# EAGLE design Lower-board (EAGLE 7.1.0)
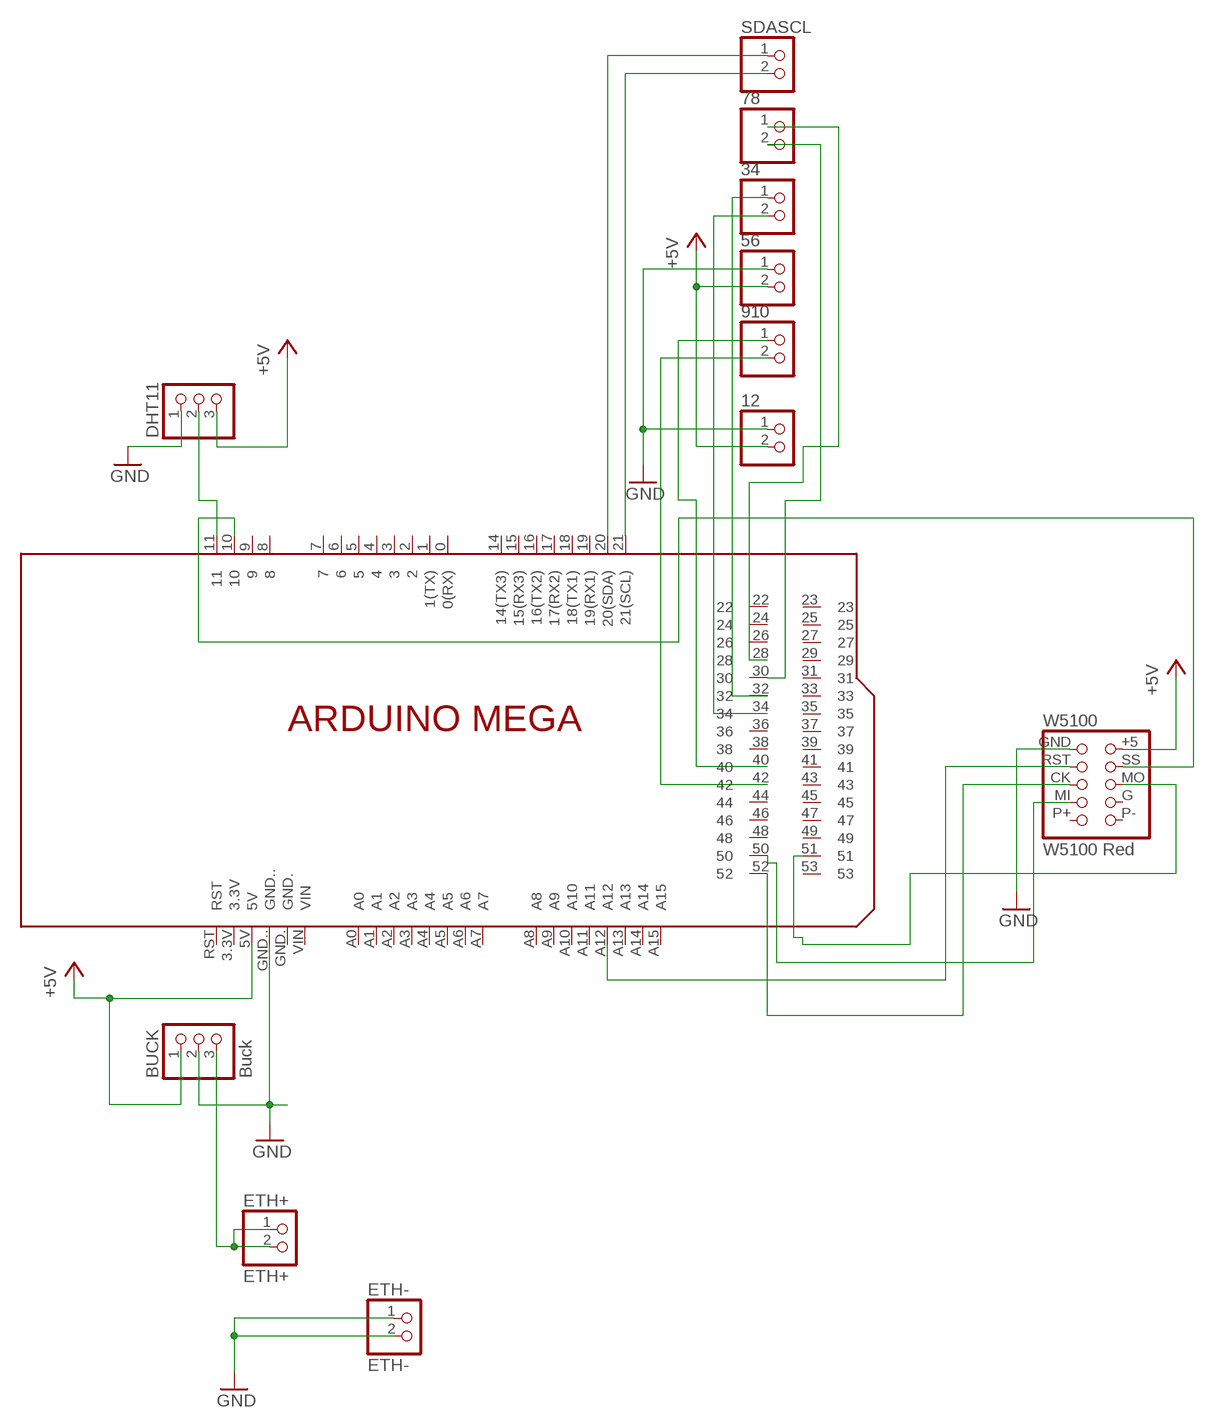
[diagram p0: schematic, sheet 1]

## Parts
12  PINHD-1X2  [1X02]
34  PINHD-1X2  [1X02]
56  PINHD-1X2  [1X02]
78  PINHD-1X2  [1X02]
910  PINHD-1X2  [1X02]
BUCK  Buck  PINHD-1X3  [1X03]
DHT11  PINHD-1X3  [1X03]
ETH+  ETH+  PINHD-1X2  [1X02]
ETH-  ETH-  PINHD-1X2  [1X02]
SDASCL  PINHD-1X2  [1X02]
U$1  ARDUINO_MEGA_1  [ARDUINO_MEGA_1]
W5100  W5100 Red  W5100-REDW5100-RED  [W5100-RED]

## Nets
+5V: 12.2 56.2 BUCK.1 DHT11.3 U$1.5V W5100.+5
GND: 12.1 56.1 BUCK.2 DHT11.1 ETH-.1 ETH-.2 U$1.GND.. W5100.GND
N$1: BUCK.3 ETH+.1 ETH+.2
N$2: SDASCL.2 U$1.21(21(SCL))
N$3: SDASCL.1 U$1.20(20(SDA))
N$4: DHT11.2 U$1.11
N$6: 910.2 U$1.42
N$7: 910.1 U$1.40
N$8: 34.2 U$1.34
N$9: 34.1 U$1.32
N$10: 78.1 U$1.28
N$12: 78.2 U$1.30
N$23: U$1.52 W5100.CK
N$24: U$1.50 W5100.MI
N$25: U$1.A12 W5100.RST
N$26: U$1.10 W5100.SS
N$27: U$1.51 W5100.MO
Unconnected: U$1.0(0(RX)) U$1.1(1(TX)) U$1.2 U$1.3 U$1.3.3V U$1.4 U$1.5 U$1.6 U$1.7 U$1.8 U$1.9 U$1.14(14(TX3)) U$1.15(15(RX3)) U$1.16(16(TX2)) U$1.17(17(RX2)) U$1.18(18(TX1)) U$1.19(19(RX1)) U$1.22 U$1.23 U$1.24 U$1.25 U$1.26 U$1.27 U$1.29 U$1.31 U$1.33 U$1.35 U$1.36 U$1.37 U$1.38 U$1.39 U$1.41 U$1.43 U$1.44 U$1.45 U$1.46 U$1.47 U$1.48 U$1.49 U$1.53 U$1.A0 U$1.A1 U$1.A2 U$1.A3 U$1.A4 U$1.A5 U$1.A6 U$1.A7 U$1.A8 U$1.A9 U$1.A10 U$1.A11 U$1.A13 U$1.A14 U$1.A15 U$1.GND. U$1.RST U$1.VIN W5100.G W5100.P+ W5100.P-

## Library data of the parts
12 34 56 78 910 ETH+ ETH- SDASCL = pinhead:PINHD-1X2: PIN HEADER
BUCK DHT11 = pinhead:PINHD-1X3: PIN HEADER
U$1 = Mat-Library:ARDUINO_MEGA_1
W5100 = w5100:W5100-RED: PIN HEADER

## Board
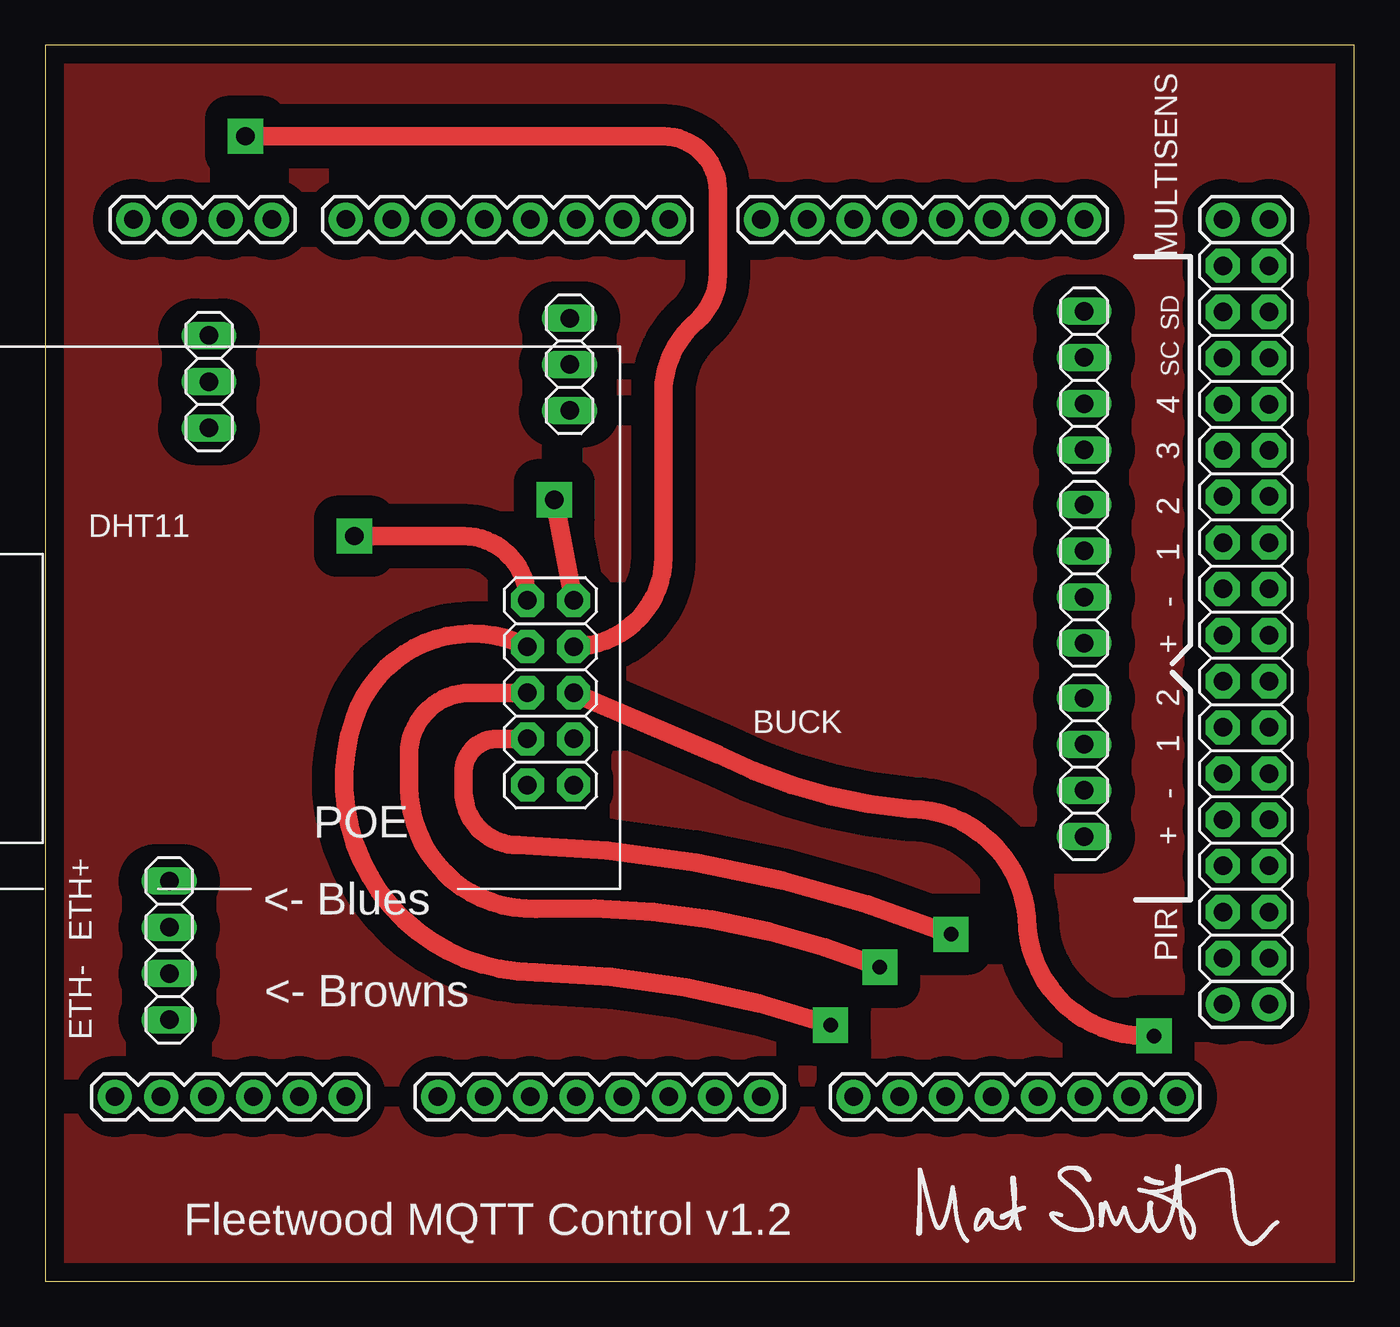
[diagram p1: board, top side]
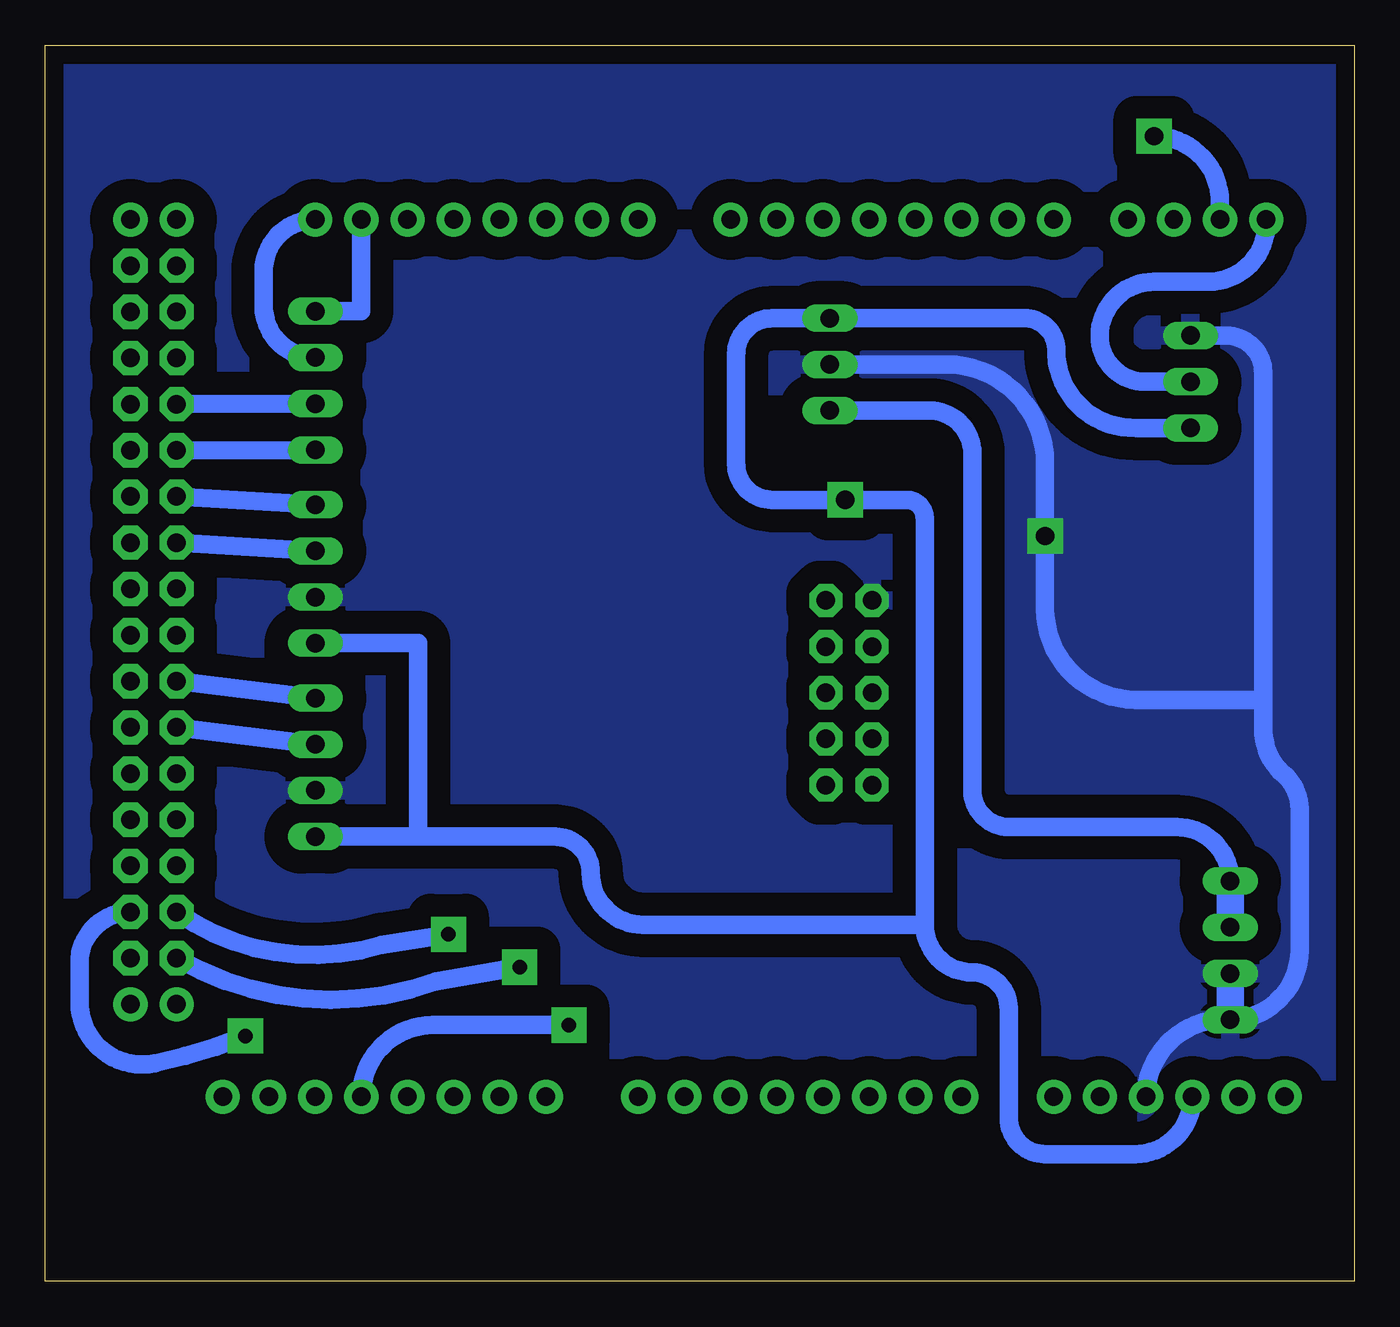
[diagram p2: board, bottom side, seen from below]

Size 72 x 68 mm. Coordinates in mm from the lower left corner, seen from the top.
Outline: 0,0 72,0 72,68 0,68 0,0
Copper layers (1*16): Top 0.035mm / dielectric 1.5mm / Bottom 0.035mm
Design rules "mat-homemade *": minimum track width 20mil, minimum drill 24mil, track to track 50mil, track to pad 30mil, pad to pad 25mil, via to via 30mil, smd to smd 8mil, copper to edge 40mil, drill to drill 8mil, minimum pad ring 10mil, minimum via ring 8mil, stop-mask expansion 4mil, vias tented up to drill 0mil, thermal gap 10mil

### Footprints (pad centres in the part's own frame; a part is rotated, then mirrored left to right if it is on the bottom)
1X02 = drill 1.016 long: 1 -1.27,0; 2 1.27,0
1X03 = drill 1.016 long: 1 -2.54,0; 2 0,0; 3 2.54,0
ARDUINO_MEGA_1 = drill 1.016 pad 1.88: 0 31.75,50.8; 1 29.21,50.8; 2 26.67,50.8; 3 24.13,50.8; 3.3V 3.81,2.54; 4 21.59,50.8; 5 19.05,50.8; 5V 6.35,2.54; 5V. 62.23,50.8; 5V.. 64.77,50.8; 6 16.51,50.8; 7 13.97,50.8; 8 9.906,50.8; 9 7.366,50.8; 10 4.826,50.8; 11 2.286,50.8; 14 36.83,50.8; 15 39.37,50.8; 16 41.91,50.8; 17 44.45,50.8; 18 46.99,50.8; 19 49.53,50.8; 20 52.07,50.8; 21 54.61,50.8; A0 19.05,2.54; A1 21.59,2.54; A2 24.13,2.54; A3 26.67,2.54; A4 29.21,2.54; A5 31.75,2.54; A6 34.29,2.54; A7 36.83,2.54; A8 41.91,2.54; A9 44.45,2.54; A10 46.99,2.54; A11 49.53,2.54; A12 52.07,2.54; A13 54.61,2.54; A14 57.15,2.54; A15 59.69,2.54; GND. 11.43,2.54; GND.. 8.89,2.54; GND... 62.23,7.62; GND.... 64.77,7.62; RST 1.27,2.54; VIN 13.97,2.54 | drill 1.016 pad 1.88 octagon: 22 62.23,48.26; 23 64.77,48.26; 24 62.23,45.72; 25 64.77,45.72; 26 62.23,43.18; 27 64.77,43.18; 28 62.23,40.64; 29 64.77,40.64; 30 62.23,38.1; 31 64.77,38.1; 32 62.23,35.56; 33 64.77,35.56; 34 62.23,33.02; 35 64.77,33.02; 36 62.23,30.48; 37 64.77,30.48; 38 62.23,27.94; 39 64.77,27.94; 40 62.23,25.4; 41 64.77,25.4; 42 62.23,22.86; 43 64.77,22.86; 44 62.23,20.32; 45 64.77,20.32; 46 62.23,17.78; 47 64.77,17.78; 48 62.23,15.24; 49 64.77,15.24; 50 62.23,12.7; 51 64.77,12.7; 52 62.23,10.16; 53 64.77,10.16
W5100-RED = drill 1.016 pad 1.829 octagon: +5 48.26,15.875; CK 45.72,10.795; G 48.26,8.255; GND 45.72,15.875; MI 45.72,8.255; MO 48.26,10.795; P+ 45.72,5.715; P- 48.26,5.715; RST 45.72,13.335; SS 48.26,13.335

### Placement (x,y rotation side)
12  57.15,25.74 270 top
34  57.15,41.46 270 top
56  57.15,36.38 270 top
78  57.15,47.02 270 top
910  57.15,30.82 270 top
BUCK  28.84,50.45 270 top
DHT11  9,49.5 270 top
ETH+  6.81,20.75 270 top
ETH-  6.81,15.67 90 top
SDASCL  57.15,52.1 270 top
U$1  2.55,7.62 0 top
W5100  -19.2,21.59 0 top

### Tracks (layer width: path | path; a pad name or v marks a point on that pad's centre or on a via)
+5V  (via drill 1 pad 1.93)
  Top 1.016: W5100.+5 v28,43
  Bottom 1.016: DHT11.3 11.96,46.96 arc90 16.38,51 arc-90 18,53 arc45 18.02,52.99 BUCK.1 32.01,52.99 arc-90 34,51 34,45 arc-90 32,43 v28,43 24.62,43 arc90 23.62,42 23.62,19.62 | U$1.5V arc90 12.06,7 17,7 arc90 19,9 19,15 arc-90 21,17 arc90 23.62,19.62 | 12.2 51.5,24.47 | 51.5,24.47 43.97,24.47 arc90 42,22.5 arc-90 39.12,19.62 23.62,19.62 | 56.2 51.5,35.11 51.5,24.47
GND  (via drill 1 pad 1.93)
  Top 1.016: W5100.GND W5100.GND arc90 23,41 v17,41
  Bottom 1.016: DHT11.1 7.04,52.04 arc90 5,50 5,32 | 5,32 5,30.41 arc-45 4,28 arc53 3,26 3,18.21 arc90 ETH-.1 7.2,14.4 arc-90 U$1.GND.. | BUCK.2 22.45,50.45 arc90 17,45 v17,41 17,37 arc-90 12,32 5,32
  Bottom 1.5: ETH-.2 ETH-.1
  pour Bottom: -1,69 73,69 73,-1 -1,-1
N$1
  Bottom 1.016: BUCK.3 23.38,47.91 arc90 21,45.53 21,27 arc-90 19,25 9.79,25 arc90 ETH+.1
  Bottom 1.5: ETH+.1 ETH+.2
N$2
  Bottom 1.016: U$1.21 arc-90 60,55.58 60,53.68 arc-90 SDASCL.2
N$3
  Bottom 1.016: SDASCL.1 54.62,53.37 U$1.20
N$4
  Bottom 1.016: U$1.11 4.84,58.16 arc90 8,55 11,55 arc-90 14,52 arc-90 11.5,49.5 DHT11.2
N$5
  pour Top: -1,69 73,69 73,-1 -1,-1
N$6
  Bottom 1.016: 910.2 U$1.42
N$7
  Bottom 1.016: 910.1 U$1.40
N$8
  Bottom 1.016: 34.2 U$1.34
N$9
  Bottom 1.016: U$1.32 34.1
N$10
  Bottom 1.016: U$1.28 78.1
N$12
  Bottom 1.016: 78.2 U$1.30
N$23  (via drill 0.8 pad 1.93)
  Top 1.016: W5100.CK 23.39,32.38 arc90 20,29 20,27 arc90 27,20.5 arc-24 v45.91,17.29
  Bottom 1.016: v45.91,17.29 50.5,16.5 arc50 U$1.52
N$24  (via drill 0.8 pad 1.93)
  Top 1.016: W5100.MI 24.84,29.84 arc90 23,28 23,27 arc90 26,24 arc-20 v49.83,19.09
  Bottom 1.016: v49.83,19.09 53.5,18.5 arc52 U$1.50
N$25  (via drill 0.8 pad 1.93)
  Top 1.016: W5100.RST arc97 17,31 arc109 27,17 arc-18 v43.2,14.1
  Bottom 1.016: v43.2,14.1 50.68,14.1 arc-90 U$1.A12
N$26  (via drill 1 pad 1.93)
  Top 1.016: v11,63 34,63 arc-90 37,60 37,55.41 arc-45 36,53 35.46,52.46 arc45 34,48.93 34,39.87 arc-90 W5100.SS
  Bottom 1.016: v11,63 arc90 7.38,59.38 U$1.10
N$27  (via drill 0.8 pad 1.93)
  Top 1.016: v61,13.5 60.5,13.5 arc-90 54,20 arc85 47.5,26 arc-22 37,29 W5100.MO
  Bottom 1.016: U$1.51 arc-90 70.12,17.52 70.12,15.38 arc-101 66,12 arc-11 v61,13.5

### Text on the board
tPlace: MULTISENS | SD | SC | 4 | 3 | 2 | 1 | - | + | 2 | 1 | - | + | PIR
tNames: POE | <- Blues | <- Browns | Fleetwood MQTT Control v1.2